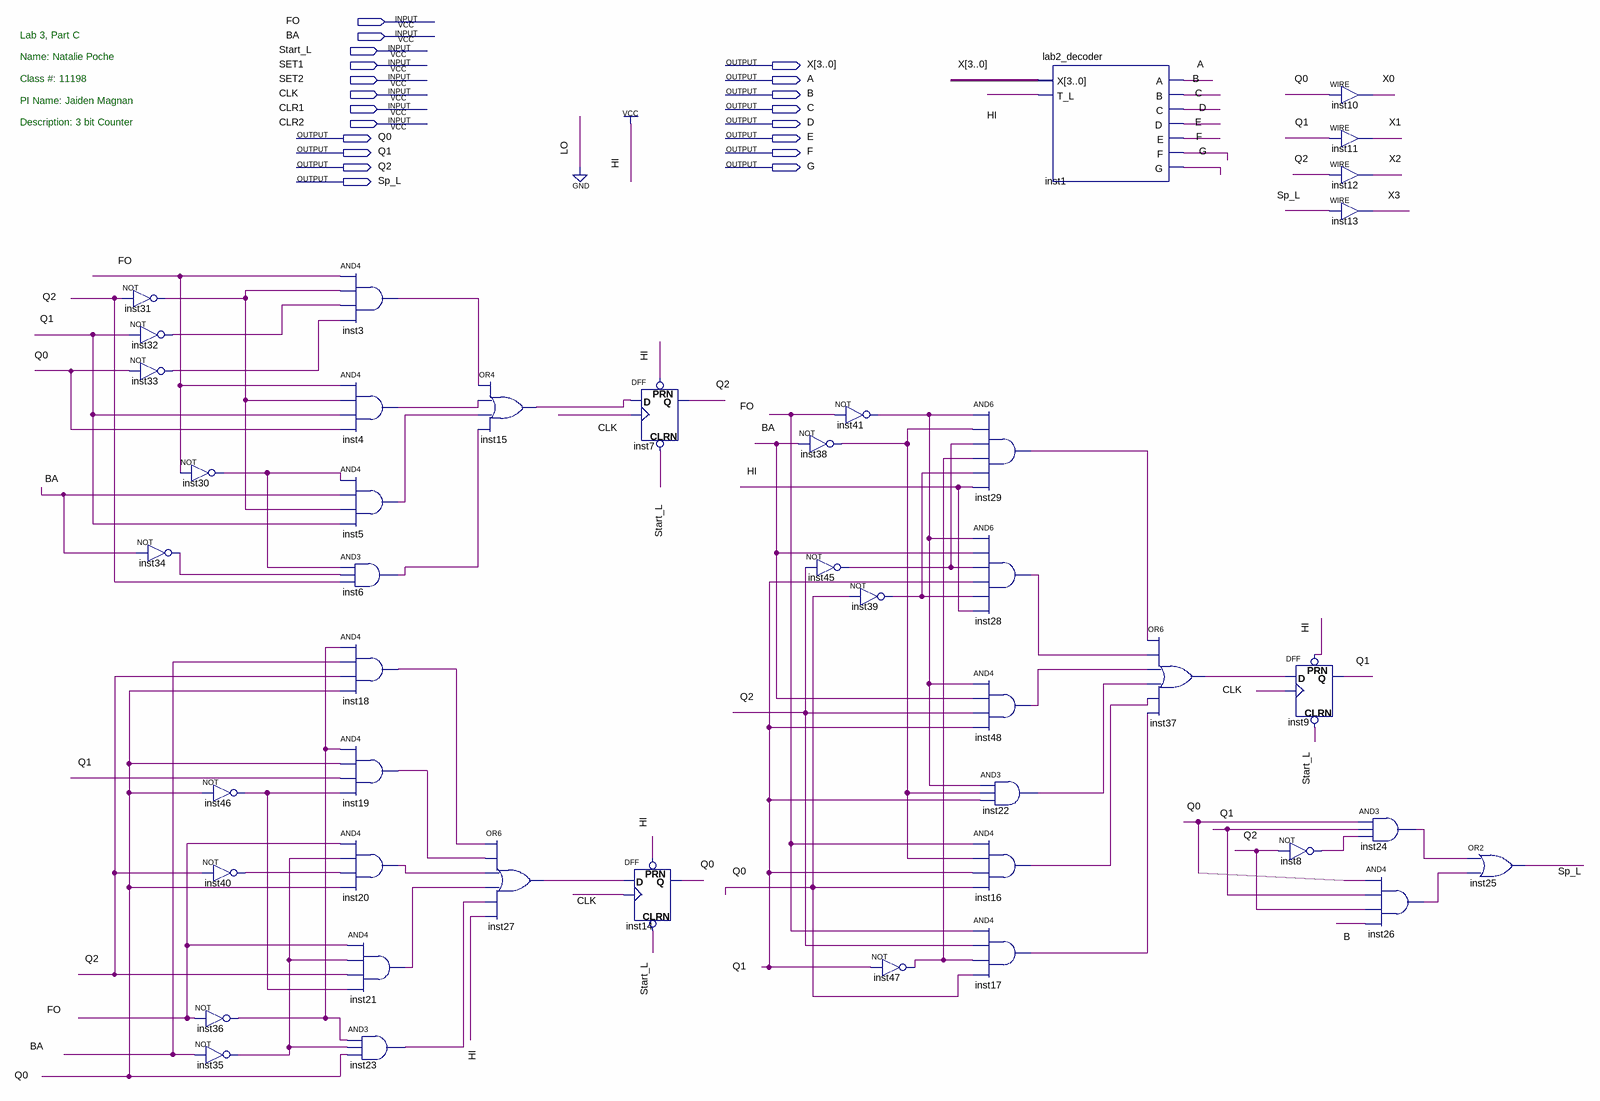
[diagram p0: schematic sheet]
// Quartus schematic Lab3_3bit_Cnt.bdf as structural Verilog: 44 symbols, 20 pins
module Lab3_3bit_Cnt (
  input  FO,
  input  BA,
  input  Start_L,
  input  SET1,
  input  SET2,
  input  CLK,
  input  CLR1,
  input  CLR2,
  output [3:0] X,
  output A,
  output B,
  output C,
  output D,
  output Q0,
  output E,
  output Q1,
  output F,
  output Q2,
  output G,
  output Sp_L
);

  wire inst3_out, inst4_out, inst5_out, inst6_out, inst8_out, inst15_out, inst16_out, inst17_out, inst18_out,
       inst19_out, inst20_out, inst21_out, inst22_out, inst23_out, inst24_out, inst26_out, inst27_out,
       inst28_out, inst29_out, inst30_out, inst31_out, inst32_out, inst33_out, inst34_out, inst35_out,
       inst36_out, inst37_out, inst38_out, inst39_out, inst40_out, inst41_out, inst45_out, inst46_out,
       inst47_out, inst48_out;

  not inst31 (inst31_out, Q2);
  not inst32 (inst32_out, Q1);
  not inst33 (inst33_out, Q0);
  not inst34 (inst34_out, BA);
  not inst30 (inst30_out, FO);
  not inst46 (inst46_out, Q0);
  not inst40 (inst40_out, Q2);
  not inst36 (inst36_out, FO);
  not inst35 (inst35_out, BA);
  and inst3 (inst3_out, FO, inst31_out, inst32_out, inst33_out);
  and inst4 (inst4_out, FO, inst31_out, Q1, Q0);
  and inst5 (inst5_out, inst30_out, BA, inst31_out, Q1);
  and inst6 (inst6_out, inst30_out, inst34_out, Q2);
  and inst18 (inst18_out, inst36_out, BA, Q2, Q0);
  and inst19 (inst19_out, inst36_out, Q0, Q1, inst46_out);
  and inst20 (inst20_out, FO, inst35_out, inst40_out, Q0);
  and inst21 (inst21_out, FO, inst35_out, Q2, inst46_out);
  and inst23 (inst23_out, inst36_out, inst35_out, Q0);
  or inst15 (inst15_out, inst3_out, inst4_out, inst5_out, inst6_out);
  or inst27 (inst27_out, inst18_out, inst19_out, inst20_out, inst21_out, inst23_out, 1'b1);
  DFF inst14 (.CLRN(Start_L), .CLK(CLK), .D(inst27_out), .PRN(1'b1), .Q(Q0));
  DFF inst7 (.CLRN(Start_L), .CLK(CLK), .D(inst15_out), .PRN(1'b1), .Q(Q2));
  not inst38 (inst38_out, BA);
  not inst41 (inst41_out, FO);
  not inst45 (inst45_out, Q2);
  not inst39 (inst39_out, Q0);
  not inst47 (inst47_out, Q1);
  and inst29 (inst29_out, inst41_out, inst38_out, inst45_out, inst47_out, inst39_out, 1'b1);
  and inst28 (inst28_out, inst41_out, BA, inst45_out, Q1, inst39_out, 1'b1);
  and inst48 (inst48_out, inst41_out, BA, Q2, Q1);
  and inst16 (inst16_out, FO, inst38_out, Q1, Q0);
  and inst17 (inst17_out, FO, Q2, inst47_out, Q0);
  and inst22 (inst22_out, inst41_out, inst38_out, Q1);
  lab2_decoder inst1 (.X(X), .T_L(1'b1), .A(A), .B(B), .C(C), .D(D), .E(E), .F(F), .G(G));
  or inst37 (inst37_out, inst29_out, inst28_out, inst48_out, inst22_out, inst16_out, inst17_out);
  DFF inst9 (.CLRN(Start_L), .CLK(CLK), .D(inst37_out), .PRN(1'b1), .Q(Q1));
  not inst8 (inst8_out, Q2);
  assign X[0] = Q0;  // WIRE inst10
  assign X[1] = Q1;  // WIRE inst11
  assign X[2] = Q2;  // WIRE inst12
  assign X[3] = Sp_L;  // WIRE inst13
  and inst24 (inst24_out, Q0, Q1, inst8_out);
  and inst26 (inst26_out, Q0, Q1, Q2, B);
  or inst25 (Sp_L, inst24_out, inst26_out);

  // Notes on the sheet:
  //   Lab 3, Part C
  //   Name: Natalie Poche
  //   Class #: 11198
  //   PI Name: Jaiden Magnan
  //   Description: 3 bit Counter
endmodule
